# EAGLE design sensor node3 (EAGLE 7.6.0)
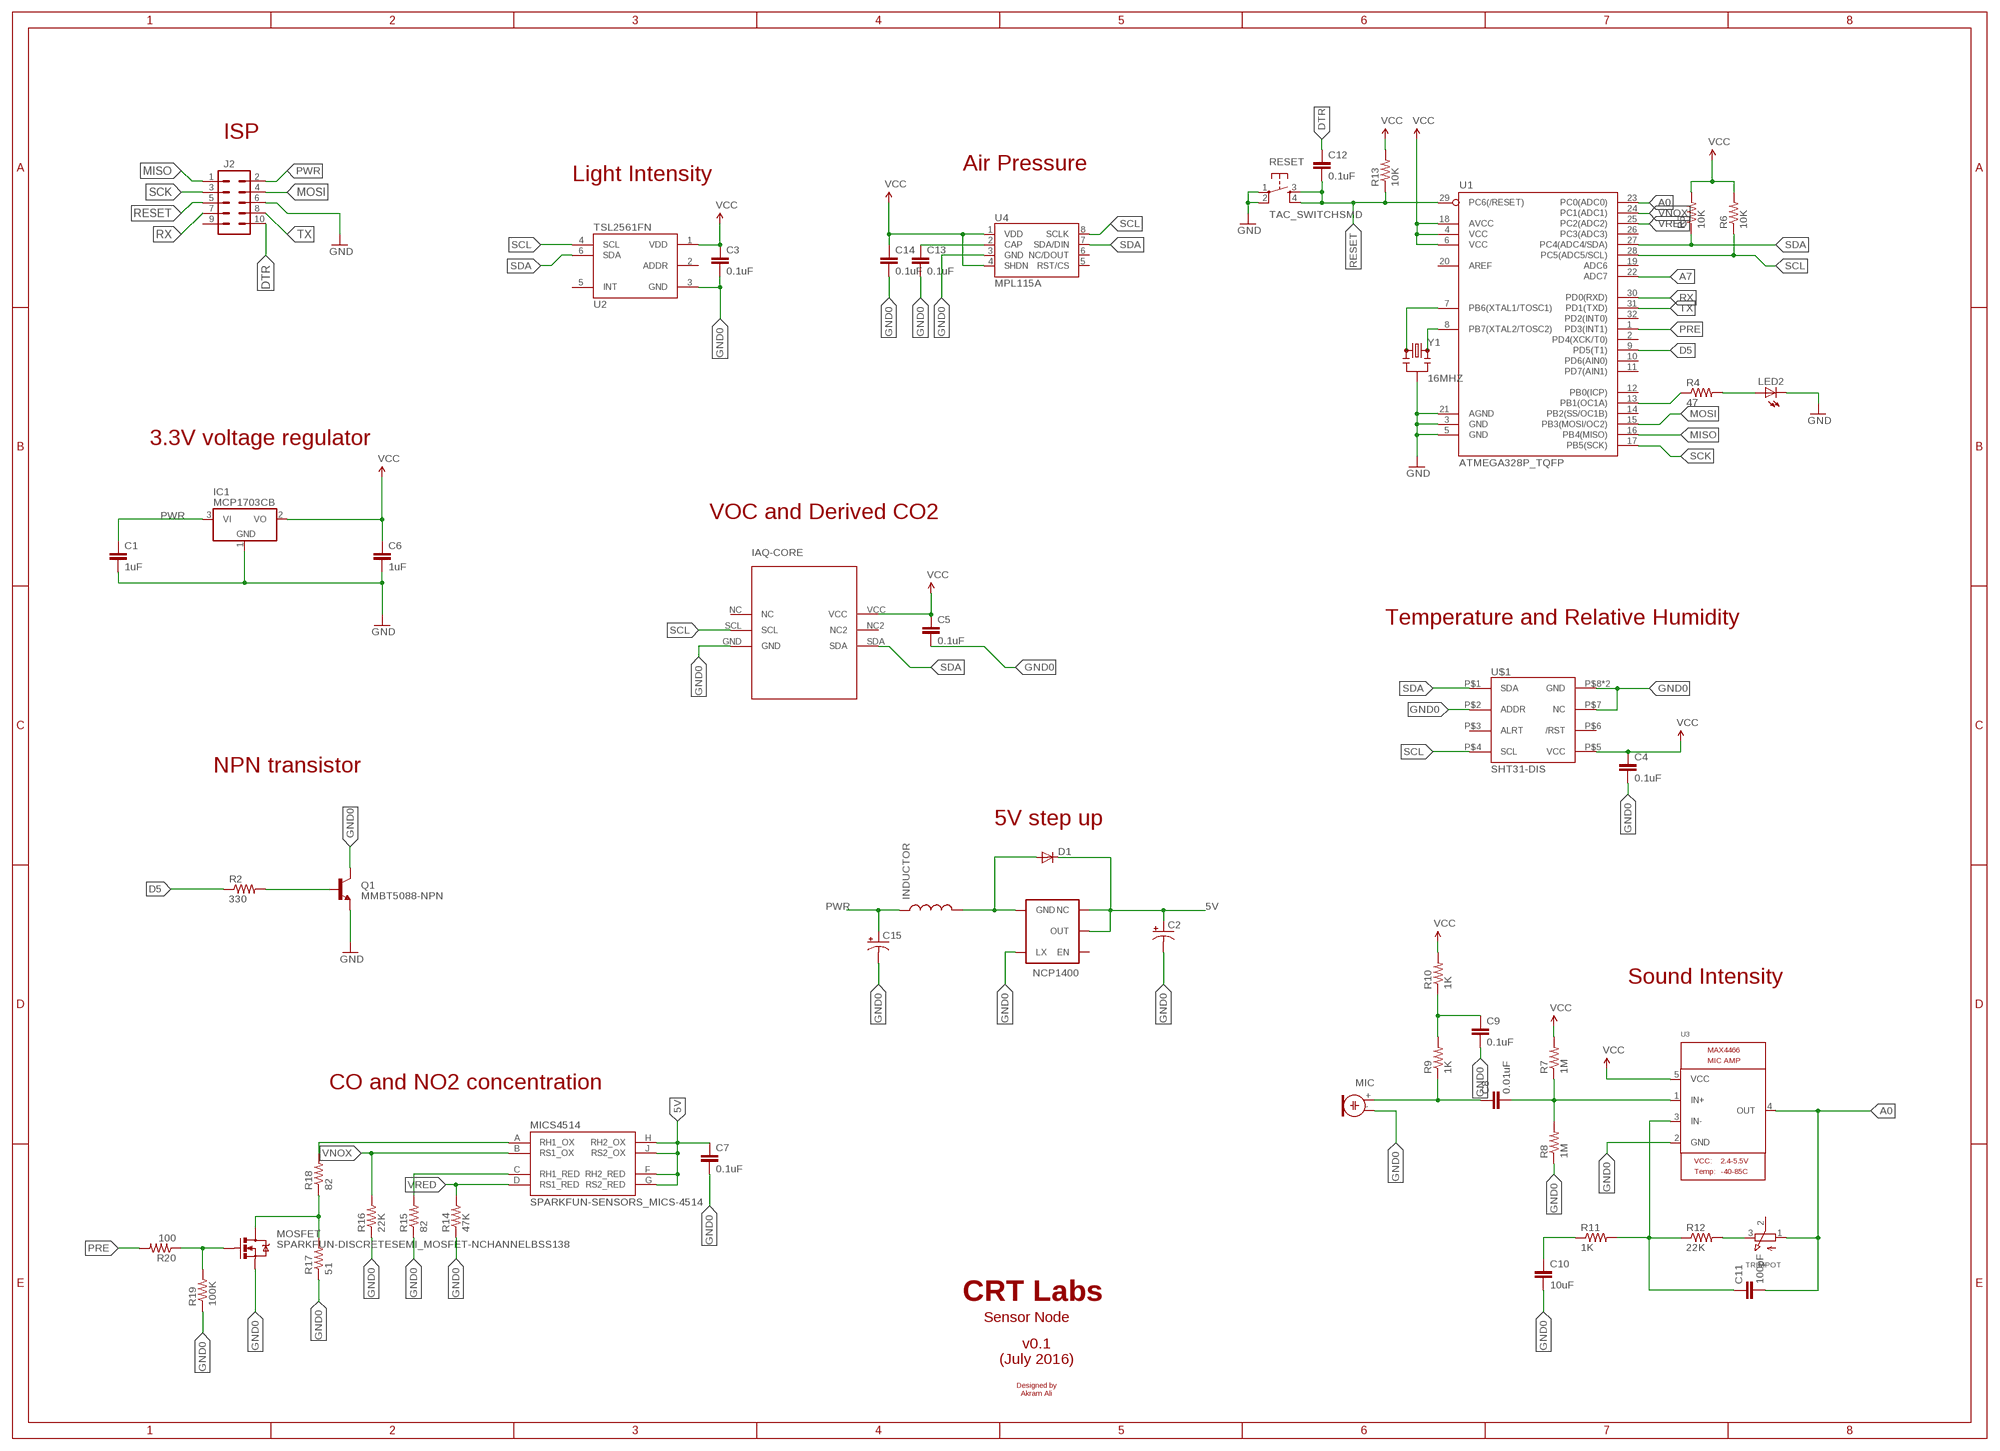
[diagram p0: schematic, sheet 1]

## Parts
C1  1uF  CAP0805  [0805]
C2  CAP_POL3528  [EIA3528]
C3  0.1uF  CAP0805  [0805]
C4  0.1uF  CAP0805  [0805]
C5  0.1uF  CAP0805  [0805]
C6  1uF  CAP0805  [0805]
C7  0.1uF  CAP0805  [0805]
C8  0.01uF  CAP0805  [0805]
C9  0.1uF  CAP0805  [0805]
C10  10uF  CAP0805  [0805]
C11  100pF  CAP0805  [0805]
C12  0.1uF  CAP0805  [0805]
C13  0.1uF  CAP0805  [0805]
C14  0.1uF  CAP0805  [0805]
C15  CAP_POL1206  [EIA3216]
D1  DIODESMA  [SMA-DIODE]
IAQ-CORE  IAQ-CORE  [IAQ-CORE]
IC1  MCP1703CB  [SOT23]
INDUCTOR  INDUCTORCR54  [CR54]
J2  M05X2PTH  [AVR_ICSP]
LED2  LEDCHIPLED_0805  [CHIPLED_0805]
MIC  ELECTRET  [ELECTRET_9.7]
MICS4514  SPARKFUN-SENSORS_MICS-4514  [SPARKFUN-SENSORS_MICS_10-SMD]
MOSFET  SPARKFUN-DISCRETESEMI_MOSFET-NCHANNELBSS138  [SPARKFUN-DISCRETESEMI_SOT23-3]
NCP1400  V_REG_NCP1400SOT23-5  [SOT23-5]
Q1  MMBT5088-NPN  TRANSISTOR_NPNMMBT5088  [SOT23-3]
R2  330  RESISTOR0805-RES  [0805]
R4  47  RESISTOR0805-RES  [0805]
R5  10K  RESISTOR0805-RES  [0805]
R6  10K  RESISTOR0805-RES  [0805]
R7  1M  RESISTOR0805-RES  [0805]
R8  1M  RESISTOR0805-RES  [0805]
R9  1K  RESISTOR0805-RES  [0805]
R10  1K  RESISTOR0805-RES  [0805]
R11  1K  RESISTOR0805-RES  [0805]
R12  22K  RESISTOR0805-RES  [0805]
R13  10K  RESISTOR0805-RES  [0805]
R14  47K  RESISTOR0805-RES  [0805]
R15  82  RESISTOR0805-RES  [0805]
R16  22K  RESISTOR0805-RES  [0805]
R17  51  RESISTOR0805-RES  [0805]
R18  82  RESISTOR0805-RES  [0805]
R19  100K  RESISTOR0805-RES  [0805]
R20  100  RESISTOR0805-RES  [0805]
RESET  TAC_SWITCHSMD  [TACTILE-SWITCH-SMD]
TRIMPOT  TRIMPOTTC33X-2  [TRIMPOT_BOURNS_TC33X-2]
U1  ATMEGA328P_TQFP  [TQFP32-08]
U2  TSL2561FN  [FN-6]
U3  MAX4466""  [SC70-5]
U4  MPL115A  [LGA8]
U$1  SHT31-DIS  [SHT3X]
Y1  16MHZ  RESONATOR16MHZ  [RESONATOR-SMD]

## Nets
5V: C2.A(+) C7.1 D1.C MICS4514.F(RH2_RED) MICS4514.G(RS2_RED) MICS4514.H(RH2_OX) MICS4514.J(RS2_OX) NCP1400.2(OUT) NCP1400.3(NC)
A0: C11.2 TRIMPOT.1(A) U1.23(PC0(ADC0)) U3.4(OUT)
A7: U1.22(ADC7)
D5: R2.1 U1.9(PD5(T1))
DTR: C12.1 J2.10
GND: C1.2 C6.2 IC1.1(GND) J2.6 LED2.C Q1.2(E) RESET.1 RESET.2 U1.3(GND) U1.5(GND) U1.21(AGND) Y1.2
GND0: C2.C(-) C3.2 C4.2 C5.2 C7.2 C9.2 C10.2 C13.2 C14.2 C15.C(-) IAQ-CORE.GND MIC.- MOSFET.2(S) NCP1400.5(LX) Q1.3(C) R8.1 R14.1 R15.1 R16.1 R17.1 R19.1 U2.3(GND) U3.2(GND) U4.3(GND) U$1.P$2(ADDR) U$1.P$7(NC) U$1.P$8(GND) U$1.PAD(GND)
MISO: J2.1 U1.16(PB4(MISO))
MOSI: J2.4 U1.15(PB3(MOSI/OC2))
N$1: Q1.1(B) R2.2
N$2: R4.1 U1.13(PB1(OC1A))
N$3: LED2.A R4.2
N$4: U1.8(PB7(XTAL2/TOSC2)) Y1.3
N$5: U1.7(PB6(XTAL1/TOSC1)) Y1.1
N$6: C8.2 R7.1 R8.2 U3.1(IN+)
N$7: C11.1 R11.2 R12.1 U3.3(IN-)
N$8: MICS4514.A(RH1_OX) R18.2
N$9: C8.1 MIC.+ R9.1
N$10: C9.1 R9.2 R10.1
N$12: C13.1 U4.2(CAP)
N$13: MICS4514.C(RH1_RED) R15.2
N$15: C10.1 R11.1
N$16: R12.2 TRIMPOT.3(E)
N$18: D1.A INDUCTOR.P$2 NCP1400.4(GND)
N$20: MOSFET.3(D) R17.2 R18.1
N$23: MOSFET.1(G) R19.2 R20.1
PRE: R20.2 U1.1(PD3(INT1))
PWR: C1.1 C15.A(+) IC1.3(VI) INDUCTOR.P$1 J2.2
RESET: C12.2 J2.5 R13.1 RESET.3 RESET.4 U1.29(PC6(/RESET))
RX: J2.7 U1.30(PD0(RXD))
SCK: J2.3 U1.17(PB5(SCK))
SCL: IAQ-CORE.SCL R6.1 U1.28(PC5(ADC5/SCL)) U2.4(SCL) U4.8(SCLK) U$1.P$4(SCL)
SDA: IAQ-CORE.SDA R5.1 U1.27(PC4(ADC4/SDA)) U2.6(SDA) U4.7(SDA/DIN) U$1.P$1(SDA)
TX: J2.8 U1.31(PD1(TXD))
VCC: C3.1 C4.1 C5.1 C6.1 C14.1 IAQ-CORE.VCC IC1.2(VO) R5.2 R6.2 R7.2 R10.2 R13.2 U1.4(VCC) U1.6(VCC) U1.18(AVCC) U2.1(VDD) U3.5(VCC) U4.1(VDD) U4.4(SHDN) U$1.P$5(VCC)
VNOX: MICS4514.B(RS1_OX) R16.2 U1.24(PC1(ADC1))
VRED: MICS4514.D(RS1_RED) R14.2 U1.25(PC2(ADC2))
Unconnected: IAQ-CORE.NC IAQ-CORE.NC2 J2.9 NCP1400.1(EN) TRIMPOT.2(S) U1.2(PD4(XCK/T0)) U1.10(PD6(AIN0)) U1.11(PD7(AIN1)) U1.12(PB0(ICP)) U1.14(PB2(SS/OC1B)) U1.19(ADC6) U1.20(AREF) U1.26(PC3(ADC3)) U1.32(PD2(INT0)) U2.2(ADDR) U2.5(INT) U4.5(RST/CS) U4.6(NC/DOUT) U$1.P$3(ALRT) U$1.P$6(/RST)

## Notes on the sheet
- ISP
- Air Pressure
- Light Intensity
- 3.3V voltage regulator
- VOC and Derived CO2
- Temperature and Relative Humidity
- NPN transistor
- 5V step up
- Sound Intensity
- CO and NO2 concentration
- CRT Labs
- Sensor Node
- v0.1
  (July 2016)
- Designed by
  Akram Ali

## Library data of the parts
C1 C6 = SparkFun-Capacitors:CAP: Capacitor Standard 0603 ceramic capacitor, and 0.1" leaded capacitor.; OC_NEWARK: unknown
C2 C15 = SparkFun:CAP_POL: Capacitor Polarized These are standard SMD and PTH capacitors. Normally 10uF, 47uF, and 100uF in electrolytic and tantalum varieties. Always verify the external diameter of the through hole cap, it varies with capacity, voltage, and manufacturer. The EIA devices should be standard.
C3-C5 C7 = SparkFun-Passives:CAP: Capacitor Standard 0603 ceramic capacitor, and 0.1" leaded capacitor.; OC_NEWARK: unknown
C8-C14 = SparkFun-Passives:CAP: Capacitor Standard 0603 ceramic capacitor, and 0.1" leaded capacitor.
D1 = SparkFun:DIODE: Diode These are standard reverse protection diodes and small signal diodes. SMA package can handle up to about 1A. SOD-323 can handle about 200mA. What the SOD-323 package when ordering, there are some mfgs out there that are 5-pin packages.
IAQ-CORE = IAQ-CORE:IAQ-CORE; MPN: IAQ CORE; OC_NEWARK: 82Y5455
IC1 = linear:MCP1703: 250 mA, 16V, Low Quiescent Current LDO Regulator Source: http://ww1.microchip.com/downloads/en/DeviceDoc/22049b.pdf; MPN: MCP1703T-2502E/CB; OC_NEWARK: 18T9177
INDUCTOR = SparkFun:INDUCTOR: Inductors Basic Inductor/Choke - 0603 and 1206. Footprints are not proven and vary greatly between part numbers.
J2 = SparkFun-Connectors:M05X2: Header 5x2 Standard 10-pin dual row 0.1" header. Commonly used with AVR-ISP. Use with Spark Fun Electronics SKU: PRT-00778
LED2 = adafruit:LED: LED OSRAM: - CHIPLED LG R971, LG N971, LY N971, LG Q971, LY Q971, LO R971, LY R971 LH N974, LH R974 LS Q976, LO Q976, LY Q976 LO Q996 - Hyper CHIPLED LW Q18S LB Q993, LB Q99A, LB R99A - SideLED LS A670, LO A670, LY A670, LG A670, LP A670 LB A673, LV A673, LT A673, LW A673 LH A674 LY A675 LS A676, LA A676, LO A676, LY A676, LW A676 LS A679, LY A679, LG A679 - Hyper Micro SIDELED® LS Y876, LA Y876, LO Y876, LY Y876 LT Y87S - SmartLED LW L88C, LW L88S LB L89C, LB L89S, LG L890 LS L89K, LO L89K, LY L89K LS L896, LA L896, LO L896, LY L896 - TOPLED LS T670, LO T670, LY T670, LG T670, LP T670 LSG T670, LSP T670, LSY T670, LOP T670, LYG T670 LG T671, LOG T671, LSG T671 LB T673, LV T673, LT T673, LW T673 LH T674 LS T676, LA T676, LO T676, LY T676, LB T676, LH T676, LSB T676, LW T676 LB T67C, LV T67C, LT T67C, LS T67K, LO T67K, LY T67K, LW E67C LS E67B, LA E67B, LO E67B, LY E67B, LB E67C, LV E67C, LT E67C LW T67C LS T679, LY T679, LG T679 LS T770, LO T770, LY T770, LG T770, LP T770 LB T773, LV T773, LT T773, LW T773 LH T774 LS E675, LA E675, LY E675, LS T675 LS T776, LA T776, LO T776, LY T776, LB T776 LHGB T686 LT T68C, LB T68C - Hyper Mini TOPLED® LB M676 - Mini TOPLED Santana® LG M470 LS M47K, LO M47K, LY M47K Source: http://www.osram.convergy.de/; OC_NEWARK: unknown
MIC = microbuilder:ELECTRET: Electret microphone Thru hole 2.54mm spacing with 9.7mm diameter
MICS4514 = MICS-4514_CO_and_NOx_Sensor_Breakout:SPARKFUN-SENSORS_MICS-4514: Metal oxide MEMS carbon monoxide (CO) and NOx sensor in an SMD package.; PROD_ID: COMP-12310
MOSFET = MICS-4514_CO_and_NOx_Sensor_Breakout:SPARKFUN-DISCRETESEMI_MOSFET-NCHANNEL: Common NMOSFET Parts MFG P/N Store ID Prod ID FDD8780 TRANS-09984 SI7820DN TRANS-11055 FDS6630A IC-08089 2N7002PW TRANS-11151 FQP30N06L COM-10213 TRANS-10060 BSS123LT1G TRANS-08345 BSS138 TRANS-00830 BS170 2N7000; PROD_ID: TRANS-00830
NCP1400 = SparkFun:V_REG_NCP1400: Switching step-up voltage regulator NCP1400 switiching regulator takes single cell AA and outputs 100mA at 3.3V or 5V with minimal number of external components.
Q1 = SparkFun-DiscreteSemi:TRANSISTOR_NPN: Generic NPN BJT MMBT2222A - TRANS-08049 (SOT-23, 1A 40V) MPSA42 - TRANS-09116 (SOT-23, 500mA 300V) MMBT5088LT1G - TRANS-11160 (SOT-23, 50 mA 30V) BC547 - COM-08928 <http://www.sparkfun.com/products/8928> (TO-92 45V 100mA) (1.Collector 2.Base 3.Emitter) 2N3904 - COM-00521 <http://www.sparkfun.com/products/521> (TO-92 40V 200mA) (1.Emitter 2.Base 3.Collector) P2N2222A - COM-12852 <http://www.sparkfun.com/products/12852> (TO-92 40V 600mA) (1.Collector 2.Base 3.Emitter); OC_NEWARK: unknown; PROD_ID: TRANS-11160; VALUE: MMBT5088
R2 R14-R20 = SparkFun-Passives:RESISTOR: Resistor Basic schematic elements and footprints for 0603, 1206, and PTH resistors.; OC_NEWARK: unknown
R4-R6 = SparkFun-Resistors:RESISTOR: Resistor Basic schematic elements and footprints for 0603, 1206, and PTH resistors.; OC_NEWARK: unknown
R7-R13 = SparkFun-Passives:RESISTOR: Resistor Basic schematic elements and footprints for 0603, 1206, and PTH resistors.
RESET = SparkFun-Retired:TAC_SWITCH: Momentary Switch Button commonly used for reset or general input. Spark Fun Electronics SKU : COM-00097 SMT- SWCH-08247; PROD_ID: SWCH-08247
TRIMPOT = microbuilder:TRIMPOT: 3-Pin SMT Trimpots Bourns TC33 (X-2) Series 10K - Digikey: TC33X-2-103E 100K - Digikey: TC33X-104ECT-ND Bourns 3303 (W) Series 3mm 10K Single Turn - Digikey: 3303W-103ETR-ND 3mm 100K Single Turn - Digikey: 3303X-104ETR-ND
U1 = SparkFun-DigitalIC:ATMEGA328P_TQFP; MPN: ATMEGA328PB-AU; OC_NEWARK: 58Y6083; PROD_ID: IC-09069
U2 = SparkFun-DigitalIC:TSL2561: TSL2561 illumination sensor Approximates Human Eye Response Precisely Measures Illuminance Programmable Interrupt Function with User-Defined Upper and Lower Threshold 400 KHz I2C interface Programmable Analog Gain and Integration Time Supporting 1,000,000-to-1 Dynamic Range Automatically Rejects 50/60-Hz Lighting Ripple Low Active Power (0.75 mW Typical) with Power Down Mode RoHS Compliant The TSL2561 is a light-to-digital converter that transform light intensity to a digital signal output via I2C interface. The device combines one broadband photodiode (visible plus infrared) and one infrared-responding photodiode on a single CMOS integrated circuit capable of providing a near-photopic response over an effective 20-bit dynamic range (16-bit resolution). Two integrating ADCs convert the photodiode currents to a digital output that represents the irradiance measured on each channel. This digital output can be input to a microprocessor where illuminance (ambient light level) in lux is derived using an empirical formula to approximate the human eye response. The TSL2561 device supports a traditional level style interrupt that remains asserted until the firmware clears it.; DIGIKEY#: TSL2561-FNCT-ND; MANF: AMS-TAOS-USA-Inc.; MANF#: TSL2561FN; MOUSER#: 856-TSL2561T; MPN: TSL2561FN; OC_NEWARK: 82Y5564; PROD_ID: IC-11791
U3 = microbuilder:MAX4466: MAX4466 - Microphone Pre-Amp; MPN: MAX4466EXK+T; OC_NEWARK: 73Y4168
U4 = SparkFun-Sensors:MPL115A: MPL115A1 (SPI) and MPL115A2 (I2C) Miniature Digital Barometer 5.0x3.0x1.2mm LGA Package
U$1 = thomasb9511:SHT31-DIS; MPN: SHT31-DIS-B; OC_NEWARK: 47Y1304
Y1 = SparkFun-FreqCtrl:RESONATOR: Resonator Small SMD resonator. Used, eg, on the Arduino Pro/ Pro Mini boards. 8MHz- XTAL-08895 16MHz- XTAL-08900; OC_NEWARK: unknown; PROD_ID: XTAL-08900

## Board
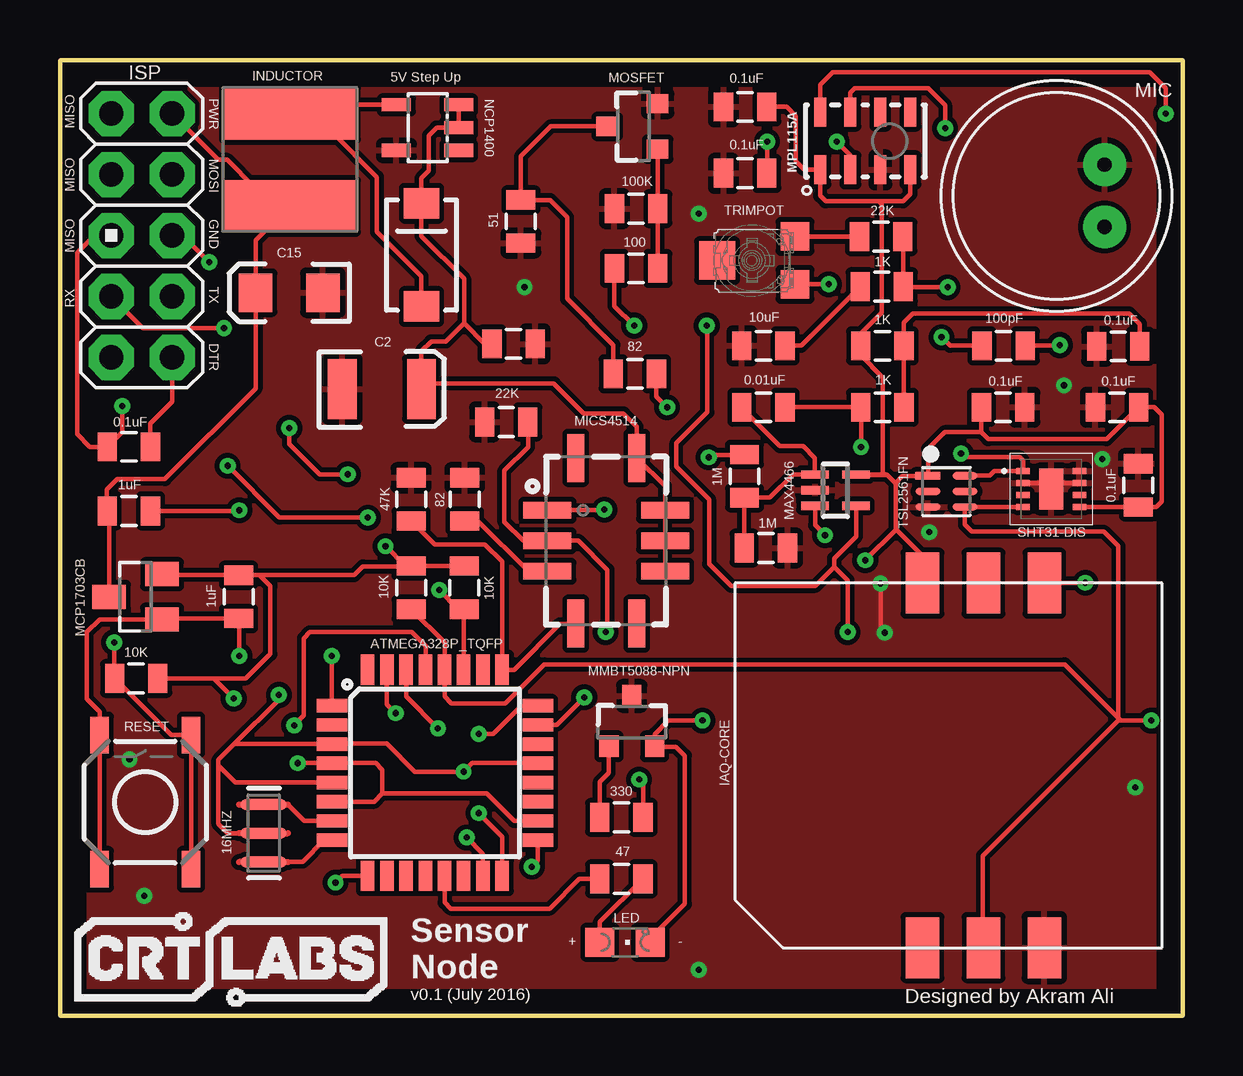
[diagram p1: board, top side]
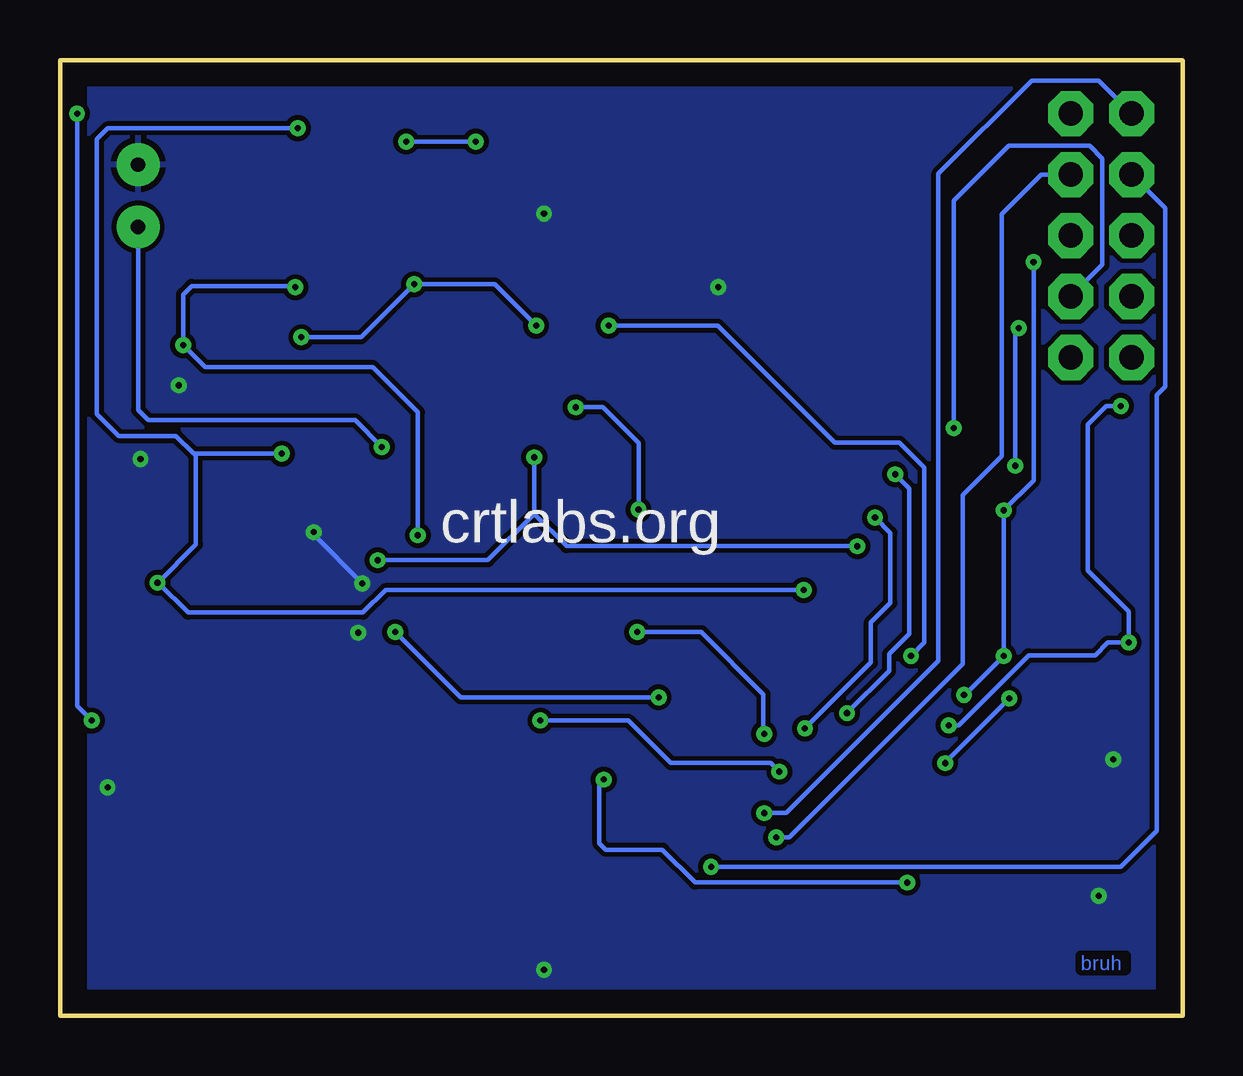
[diagram p2: board, bottom side, seen from below]

Size 46.79 x 39.85 mm. Coordinates in mm from the lower left corner, seen from the top.
Outline: 0.03,39.85 46.79,39.85 46.79,0 0,0 0,39.83
Copper layers (1*16): Top 0.035mm / dielectric 1.5mm / Bottom 0.035mm
Design rules "default": minimum track width 10mil, minimum drill 24mil, track to track 8mil, track to pad 8mil, pad to pad 8mil, via to via 8mil, smd to smd 8mil, copper to edge 40mil, drill to drill 8mil, minimum pad ring 10mil, minimum via ring 8mil, stop-mask expansion 4mil, vias tented up to drill 0mil, thermal gap 10mil

### Footprints (pad centres in the part's own frame; a part is rotated, then mirrored left to right if it is on the bottom)
0805 = smd 0.8 x 1.2: 1 -0.9,0; 2 0.9,0
EIA3528 = smd 1.2 x 2.5: A 1.65,0; C -1.65,0
EIA3216 = smd 1.4 x 1.6: A 1.4,0; C -1.4,0
SMA-DIODE = smd 1.27 x 1.47: A -2.15,0; C 2.15,0
IAQ-CORE = smd 2.54 x 1.4: GND 0,-12.9; NC 0,-7.82; NC2 15.2,-10.36; SCL 0,-10.36; SDA 15.2,-12.9; VCC 15.2,-7.82
SOT23 = smd 1 x 1.4: 1 -0.95,-1.1; 2 0.95,-1.1; 3 0,1.1
CR54 = smd 5.5 x 2.15: P$1 0,1.92; P$2 0,-1.92
AVR_ICSP = drill 1.016 pad 1.88 octagon: 1 -1.27,5.08; 2 1.27,5.08; 3 -1.27,2.54; 4 1.27,2.54; 5 -1.27,0; 6 1.27,0; 7 -1.27,-2.54; 8 1.27,-2.54; 9 -1.27,-5.08; 10 1.27,-5.08
CHIPLED_0805 = smd 1.2 x 1.2: A 0,-1.05; C 0,1.05
ELECTRET_9.7 = drill 0.6 pad 1.778: + 1.3,2; - -1.3,2
SPARKFUN-SENSORS_MICS_10-SMD = smd 0.7 x 2: A 1.27,2.45; B 0,2.45; C -1.27,2.45; F -1.27,-2.45; G 0,-2.45; H 1.27,-2.45 | smd 2 x 0.7: D -3.45,1.27; E -3.45,-1.27; J 3.45,-1.27; K 3.45,1.27
SPARKFUN-DISCRETESEMI_SOT23-3 = smd 0.8 x 0.9: 1 -0.95,-1; 2 0.95,-1; 3 0,1.1
SOT23-5 = smd 0.55 x 1.2: 1 -0.95,-1.3; 2 0,-1.3; 3 0.95,-1.3; 4 0.95,1.3; 5 -0.95,1.3
SOT23-3 = smd 0.8 x 0.9: 1 -0.95,-1; 2 0.95,-1; 3 0,1.1
TACTILE-SWITCH-SMD = smd 1.524 x 0.762: 1 -2.794,1.905; 2 2.794,1.905; 3 -2.794,-1.905; 4 2.794,-1.905
TRIMPOT_BOURNS_TC33X-2 = smd 1.2 x 1.2: 1 -1,-1.8; 3 1,-1.8 | smd 1.6 x 1.5: 2 0,1.45
TQFP32-08 = smd 1.27 x 0.559: 1 -4.293,2.8; 2 -4.293,2; 3 -4.293,1.2; 4 -4.293,0.4; 5 -4.293,-0.4; 6 -4.293,-1.2; 7 -4.293,-2; 8 -4.293,-2.8; 17 4.293,-2.8; 18 4.293,-2; 19 4.293,-1.2; 20 4.293,-0.4; 21 4.293,0.4; 22 4.293,1.2; 23 4.293,2; 24 4.293,2.8 | smd 0.559 x 1.27: 9 -2.8,-4.293; 10 -2,-4.293; 11 -1.2,-4.293; 12 -0.4,-4.293; 13 0.4,-4.293; 14 1.2,-4.293; 15 2,-4.293; 16 2.8,-4.293; 25 2.8,4.293; 26 2,4.293; 27 1.2,4.293; 28 0.4,4.293; 29 -0.4,4.293; 30 -1.2,4.293; 31 -2,4.293; 32 -2.8,4.293
FN-6 = smd 1.05 x 0.3: 1 -0.775,0.65; 2 -0.775,0; 3 -0.775,-0.65; 4 0.775,-0.65; 5 0.775,0; 6 0.775,0.65
SC70-5 = smd 0.35 x 1.15: 1 -0.65,-0.85; 2 0,-0.85; 3 0.65,-0.85; 4 0.65,0.85; 5 -0.65,0.85
LGA8 = smd 1.2 x 0.5: 1 -1.2,1.875; 2 -1.2,0.625; 3 -1.2,-0.625; 4 -1.2,-1.875; 5 1.2,-1.875; 6 1.2,-0.625; 7 1.2,0.625; 8 1.2,1.875
SHT3X = smd 0.55 x 0.25: P$1 -1.175,0.75; P$2 -1.175,0.25; P$3 -1.175,-0.25; P$4 -1.175,-0.75; P$5 1.175,-0.75; P$6 1.175,-0.25; P$7 1.175,0.25; P$8 1.175,0.75 | smd 1 x 1.7: PAD 0,0
RESONATOR-SMD = smd 0.45 x 1.905: 1 -1.2,0; 2 0,0; 3 1.2,0

### Placement (x,y rotation side)
C1  2.87,21.06 0 top
C2  13.41,26.14 0 top
C3  39.29,25.37 0 top
C4  44.04,25.37 180 top
C5  44.93,22.12 90 top
C6  7.44,17.48 270 top
C7  18.9,28.02 0 top
C8  29.31,25.37 180 top
C9  44.09,27.91 180 top
C10  29.31,27.94 180 top
C11  39.32,27.94 180 top
C12  2.87,23.72 180 top
C13  28.55,35.13 180 top
C14  28.55,37.9 180 top
C15  9.55,30.15 180 top
D1  15.06,31.72 90 top
IAQ-CORE  28.12,2.84 90 top
IC1  3.15,17.48 90 top
INDUCTOR  9.58,35.69 180 top
J2  3.4,32.54 0 top
LED2  23.55,3.07 270 top
MIC  41.53,34.19 270 top
MICS4514  22.76,19.81 90 top
MOSFET  23.9,37.08 90 top
NCP1400  15.32,37.03 90 top
Q1  23.83,12.24 0 top
R2  23.39,8.28 180 top
R4  23.39,5.71 0 top
R5  16.84,17.86 90 top
R6  14.63,17.86 90 top
R7  28.52,22.5 90 top
R8  29.41,19.51 180 top
R9  34.26,25.37 0 top
R10  34.26,27.94 180 top
R11  34.24,30.4 0 top
R12  34.21,32.49 180 top
R13  3.17,14.07 0 top
R14  14.63,21.54 270 top
R15  16.87,21.54 270 top
R16  18.59,24.77 0 top
R17  19.2,33.12 90 top
R18  23.95,26.77 0 top
R19  24,33.66 0 top
R20  24,31.17 180 top
RESET  3.56,8.92 90 top
TRIMPOT  28.83,31.5 90 top
U1  15.62,10.13 0 top
U2  36.93,21.87 0 top
U3  32.31,21.92 270 top
U4  33.55,36.47 90 top
U$1  41.3,21.97 0 top
Y1  8.48,7.62 270 top

### Tracks (layer width: path | path; a pad name or v marks a point on that pad's centre or on a via)
5V
  Top 0.178: NCP1400.3 NCP1400.2 15.7,37.03 15.37,36.7 15.37,35.23 15.06,34.92 D1.C 15.06,32.51 16.84,30.73 16.84,28.88 | 16.84,28.88 16.08,28.12 15.47,28.12 15.06,27.71 C2.A 15.29,26.37 20.57,26.37 21.82,25.12 23.47,25.12 24.03,24.56 MICS4514.J 25.21,22.08 MICS4514.H MICS4514.G MICS4514.F | C7.1 17.7,28.02 16.84,28.88
A0  (via drill 0.25 pad 0.13)
  Top 0.178: C11.2 37.08,27.94 v36.73,28.3 | v32.03,30.51 TRIMPOT.1 | U1.23 20.69,12.13 v21.84,13.28 | v32.82,16 32.82,18.16 32.26,18.72 | 33.15,21.26 U3.4 33.17,21.26 33.17,19.99 32.26,19.08 32.26,18.72 | 32.26,18.72 31.47,17.93 27.97,17.93 27.05,18.85 27.05,21.54 25.68,22.91 25.68,23.88 26.98,25.17 26.98,28.75 v26.95,28.78
  Bottom 0.178: v36.73,28.3 34.24,28.3 v32.03,30.51 28.68,30.51 v26.95,28.78 | v21.84,13.28 30.1,13.28 v32.82,16
D5  (via drill 0.25 pad 0.13)
  Top 0.178: v24.13,9.86 24.31,9.68 24.31,8.29 R2.1 | U1.9 11.76,5.84 v11.48,5.56
  Bottom 0.178: v24.13,9.86 24.31,9.68 24.31,7.19 24.05,6.93 21.69,6.93 20.32,5.56 v11.48,5.56
DTR
  Top 0.178: C12.1 3.77,24.7 4.67,25.6 J2.10
GND  (via drill 0.25 pad 0.13)
  Top 0.178: RESET.1 RESET.2 1.65,12.67 1.12,13.21 1.12,16 1.65,16.54 4.24,16.54 IC1.1 4.3,16.58 C6.2 7.47,16.55 v7.47,15.01 | LED2.C 24.6,3.23 26.04,4.67 26.04,10.85 25.65,11.23 24.79,11.23 Q1.2 24.78,11.74 25.35,12.32 v26.77,12.32 | C1.2 7.44,21.06 v7.47,21.08 | 7.27,11.33 U1.3 11.35,11.35 13.61,11.35 14.78,10.19 v16.82,10.19 17.17,10.54 U1.21 | 7.27,11.33 6.6,10.67 6.6,10.44 | J2.6 5.11,32.54 v6.22,31.42 | v9.12,13.39 9.12,13.18 7.27,11.33 | 9.5,7.62 6.99,7.62 6.6,8 6.6,10.44 | U1.5 7.31,9.73 6.6,10.44
  Bottom 0.178: v9.12,13.39 9.09,13.39 v7.47,15.01 v7.47,21.08 6.22,22.33 v6.22,31.42 | v26.77,12.32 23.11,12.32 21.34,10.54 17.17,10.54 v16.82,10.19
GND0  (via drill 0.25 pad 0.13)
  Top 0.178: U$1.P$2 41.05,22.22 U$1.PAD 41.55,22.22 U$1.P$7 | v34.19,18.03 34.19,16.15 v34.37,15.98
  Bottom 0.178: v36.22,20.17 36.22,20.07 v34.19,18.03
  other vias: 26.62,1.93 41.83,26.29 43.43,23.22 19.35,30.38 26.62,33.45 2.9,10.69 3.51,5 44.81,9.52
  pour Top: -0.33,40.28 47.22,40.28 47.22,-0.43 -0.33,-0.43
  pour Bottom: -0.28,40.28 47.12,40.28 47.12,-0.51 -0.3,-0.51 -0.3,40.28
MISO  (via drill 0.25 pad 0.13)
  Top 0.178: U1.16 18.42,7.46 17.42,8.46 v17.45,8.46
  Bottom 0.178: v17.45,8.46 16.54,8.46 10.19,14.81 10.19,35.1 6.3,38.99 3.51,38.99 J2.1
MOSI  (via drill 0.25 pad 0.13)
  Top 0.178: U1.15 17.62,6.76 v16.94,7.44
  Bottom 0.178: v16.94,7.44 16.41,7.44 9.17,14.68 9.17,21.72 7.54,23.34 7.54,33.43 5.89,35.08 J2.4
N$1
  Top 0.178: Q1.1 22.86,11.23 22.86,10.13 22.49,9.77 R2.2
N$2
  Top 0.178: U1.13 16.02,4.73 16.28,4.47 20.4,4.47 21.64,5.71 R4.1 22.48,5.7
N$3
  Top 0.178: LED2.A 22.5,3.92 R4.2
N$4
  Top 0.178: U1.8 11.02,7.33 10.11,6.43 Y1.3
N$5
  Top 0.178: U1.7 10.19,8.13 9.5,8.82
N$6
  Top 0.178: C8.2 28.41,25.33 30,23.75 30.96,23.75 31.45,23.27 31.45,22.58 U3.1 30.56,22.58 29.58,21.6 R7.1 28.51,21.59 R8.2
N$7  (via drill 0.25 pad 0.13)
  Top 0.178: R12.1 35.14,32.46 R11.2 35.16,30.38 v36.98,30.38 | C11.1 41.63,27.94 v41.66,27.97 | U3.3 31.46,20.46 v31.88,20.04
  Bottom 0.178: v36.98,30.38 37.03,30.43 41.3,30.43 41.66,30.07 v41.66,27.97 40.74,27.05 33.76,27.05 31.88,25.17 v31.88,20.04
N$8  (via drill 0.25 pad 0.13)
  Top 0.178: MICS4514.A 22.66,21.08 v22.68,21.11 | R18.2 24.85,25.82 v25.3,25.37
  Bottom 0.178: v25.3,25.37 24.18,25.37 22.68,23.88 v22.68,21.11
N$9  (via drill 0.25 pad 0.13)
  Top 0.178: C8.1 R9.1 v33.38,23.72
  Bottom 0.178: MIC.+ 43.53,25.27 43.1,24.84 34.49,24.84 v33.38,23.72
N$10
  Top 0.178: C9.1 44.99,28.84 44.55,29.29 35.53,29.29 35.15,28.91 35.15,27.95 R10.1 | 35.41,27.98 R10.1 | R9.2 R10.1
N$12  (via drill 0.25 pad 0.13)
  Top 0.178: v29.46,36.45 29.46,35.14 C13.1 | U4.2 32.93,35.88 v32.36,36.45
  Bottom 0.178: v32.36,36.45 v29.46,36.45
N$13
  Top 0.178: R15.2 17.41,20.64 19.51,18.54 MICS4514.C
N$15
  Top 0.178: C10.1 30.88,27.94 R11.1
N$16
  Top 0.178: TRIMPOT.3 33.3,32.5 R12.2
N$18
  Top 0.178: INDUCTOR.P$2 9.95,37.98 NCP1400.4 11.39,37.98 11.3,37.9 11.3,36.88 13.21,34.98 13.21,32.69 15.06,30.84 D1.A
N$20
  Top 0.178: MOSFET.3 20.45,37.08 19.2,35.84 R17.2 20.42,34.01 21.13,33.3 21.13,29.9 23.05,27.98 R18.1
N$23
  Top 0.178: 24.92,33.67 R19.2 | R20.1 R19.2 | R19.2 MOSFET.1
PRE  (via drill 0.25 pad 0.13)
  Top 0.178: v11.33,15.01 U1.1 | R20.2 23.1,29.6 v23.93,28.78
  Bottom 0.178: v11.33,15.01 10.77,15.57 10.77,22.86 11.81,23.9 14.5,23.9 19.38,28.78 v23.93,28.78
PWR
  Top 0.178: IC1.3 2.05,20.98 C1.1 1.96,21.95 2.39,22.38 4.37,22.38 8.15,26.16 C15.A 8.15,32.34 INDUCTOR.P$1 9.18,34.16 8.1,34.16 8.1,34.54 6.96,35.69 6.6,35.69 J2.2
RESET  (via drill 0.25 pad 0.13)
  Top 0.178: RESET.3 RESET.4 4.64,11.71 R13.1 2.26,14.09 v2.26,15.57 | J2.5 1.42,32.54 0.71,31.83 0.71,24.26 1.24,23.72 C12.2 2.59,24.34 v2.59,25.43 | 15.22,14.75 U1.29 15.24,14.45 15.24,15.42 14.66,16 10.41,16 10.16,15.75 10.16,12.52 v9.75,12.12
  Bottom 0.178: v9.75,12.12 9.35,12.12 6.43,15.04 3.66,15.04 3.12,15.57 v2.26,15.57 2.26,16.87 3.96,18.57 3.96,24.66 3.2,25.43 v2.59,25.43
RX  (via drill 0.25 pad 0.13)
  Top 0.178: U1.30 14.42,13.32 v15.75,11.99 | v12.83,20.78 9.14,20.78 v6.99,22.94 | v6.83,28.68 3.45,28.68 J2.7
  Bottom 0.178: v15.75,11.99 13.01,14.73 13.01,16.41 12.19,17.22 12.19,20.14 v12.83,20.78 | v6.99,22.94 6.99,28.52 v6.83,28.68
SCK  (via drill 0.25 pad 0.13)
  Top 0.178: U1.17 19.91,6.48 v19.66,6.22
  Bottom 0.178: v19.66,6.22 2.59,6.22 1.09,7.72 1.09,25.88 0.74,26.24 0.74,33.68 J2.3
SCL  (via drill 0.25 pad 0.13)
  Top 0.178: U$1.P$4 U2.4 | U2.4 | U4.8 31.68,38.82 32.21,39.34 45.42,39.34 46.08,38.68 v46.08,37.62 | R6.1 16.02,15.57 U1.28 16.02,13.32 16.31,13.03 18.54,13.03 20.17,14.66 41.86,14.66 44.2,12.32 | U2.4 37.71,20.48 38,20.19 43.49,20.19 44.09,19.58 44.09,12.32 | 38.56,2.92 IAQ-CORE.SCL 38.46,2.87 38.46,6.68 44.09,12.32 | v45.47,12.32 44.2,12.32 | 44.2,12.32 44.09,12.32
  Bottom 0.178: v46.08,37.62 46.08,12.93 v45.47,12.32
SDA  (via drill 0.25 pad 0.13)
  Top 0.178: U2.6 38.74,22.53 38.93,22.72 U$1.P$1 40.13,23.15 39.98,23.29 37.69,23.29 v37.54,23.44 | U1.27 16.82,16.94 R5.1 | R5.1 16.7,16.96 | R5.1 16.6,16.96 v15.8,17.75 | U4.7 32.93,38.49 33.12,38.68 36.17,38.68 36.88,37.97 v36.88,37.01 | IAQ-CORE.SDA 42.71,18.04 v42.72,18.06
  Bottom 0.178: v36.88,37.01 44.81,37.01 45.26,36.55 45.26,25.1 44.35,24.18 41.96,24.18 41.22,23.44 | v15.8,17.75 33.22,17.75 34.16,16.81 41.45,16.81 42.7,18.06 v42.72,18.06 41.12,19.66 41.12,23.34 41.22,23.44 | v37.54,23.44 41.22,23.44
TX  (via drill 0.25 pad 0.13)
  Top 0.178: U1.31 13.62,13 v14,12.62 | v11.99,22.58 10.82,22.58 9.55,23.85 v9.55,24.51
  Bottom 0.178: v14,12.62 12.24,14.38 12.24,15.09 11.4,15.93 11.4,22 v11.99,22.58 | v9.55,24.51 9.55,33.99 7.26,36.27 3.89,36.27 3.35,35.74 3.35,31.32 J2.8
VCC  (via drill 0.25 pad 0.13)
  Top 0.178: U$1.P$5 C5.1 45.68,21.22 45.9,21.44 45.9,25.07 45.59,25.37 C4.1 43.61,24.04 38.67,24.04 38.38,24.33 | 38.38,24.33 38.38,25.36 C3.1 | IAQ-CORE.VCC 35.94,19.18 34.82,20.29 | 34.82,20.29 34.82,22.2 | 34.82,22.2 34.82,22.22 | 34.82,22.22 35.1,22.5 36.14,22.5 U2.1 36.17,22.53 36.17,23.65 36.86,24.33 38.38,24.33 | 34.82,22.22 34.8,22.22 34.47,22.56 34.39,22.56 | 34.39,22.56 33.17,22.56 U3.5 34.45,22.57 34.82,22.2 | C14.1 30.28,37.9 30.66,37.52 30.66,35.64 31.01,35.28 U4.1 31.67,34.19 31.9,33.96 34.11,33.96 | U4.4 35.43,34.26 35.13,33.96 34.11,33.96 | U1.6 13.1,8.93 13.44,9.27 | 13.44,9.27 13.44,10.26 13.16,10.54 U1.4 | U1.4 | 13.44,9.27 17.78,9.27 18.92,8.13 U1.18 | 34.39,22.56 34.29,22.66 34.29,26.62 33.36,27.54 R10.2 33.36,28.44 34.24,29.31 34.24,33.83 34.11,33.96 | v7.24,13.23 6.4,14.07 R13.2 7.75,14.07 8.76,15.09 8.76,17.92 8.31,18.38 | U1.4 v9.91,10.54 | IC1.2 4.3,18.38 C6.1 8.31,18.38 | 8.31,18.38 12.25,18.38 12.62,18.75 14.62,18.75 R6.2 R5.2 14.39,18.76 v13.56,19.58 | R7.2 28.51,23.39 27.13,23.39 v27.03,23.29 | 34.82,20.29 34.82,20.27 v33.55,19
  Bottom 0.178: v9.91,10.54 9.91,10.57 v7.24,13.23 | v33.55,19 28.96,19 27.03,20.93 | v13.56,19.58 25.68,19.58 27.03,20.93 | v27.03,23.29 27.03,20.93
VNOX  (via drill 0.25 pad 0.13)
  Top 0.178: R16.2 19.51,23.72 18.52,22.73 18.52,20.6 19.3,19.81 MICS4514.B 21.59,19.81 22.81,18.59 22.81,16.08 v22.73,16 | v17.45,11.76 18.06,11.76 19.23,12.93 U1.24
  Bottom 0.178: v22.73,16 20.07,16 17.48,13.41 17.48,11.79 v17.45,11.76
VRED
  Top 0.178: R14.2 15.61,19.66 17.7,19.66 18.42,18.94 U1.25 18.92,14.43 20.83,16.33 21.46,16.33 MICS4514.D

### Text on the board
Bottom: bruh
tNames: 5V Step Up | MAX4466 | LED
_tsilk: ISP | MISO | PWR | MISO | MOSI | GND | MISO | RX | TX | DTR | + | - | Sensor / Node | v0.1 (July 2016) | Designed by Akram Ali
_bsilk: crtlabs.org